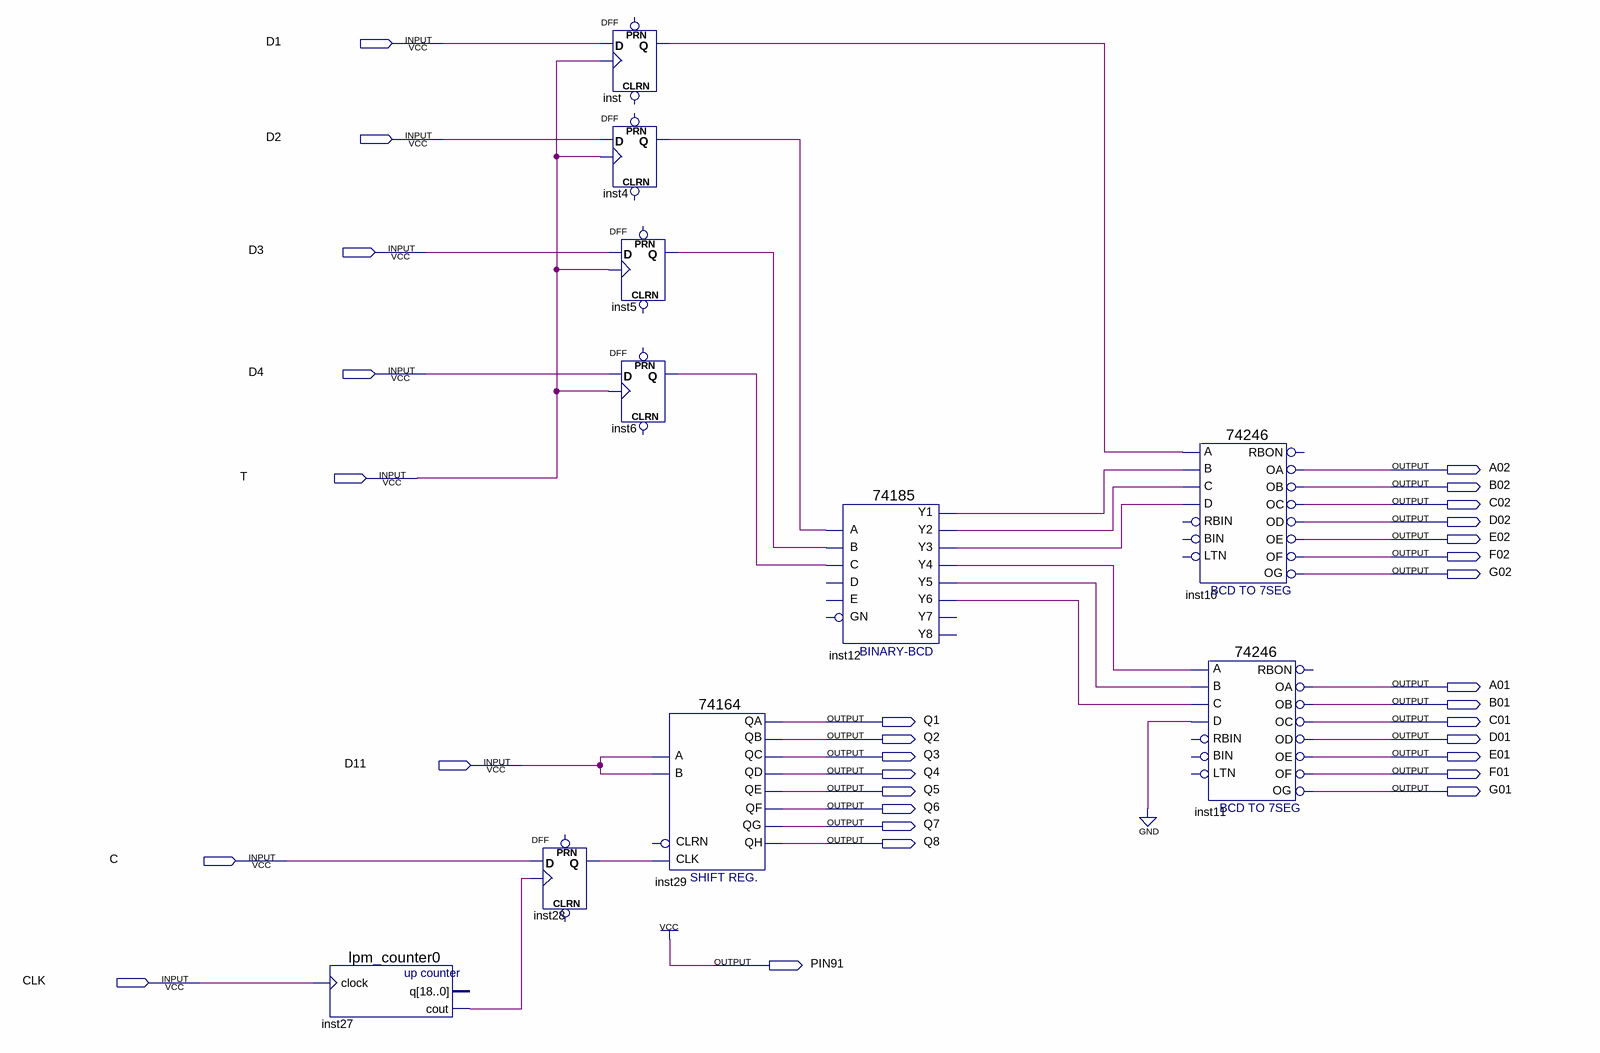
[diagram p0: schematic sheet]
// Quartus schematic registers.bdf as structural Verilog: 10 symbols, 31 pins
module registers (
  input  D1,
  input  D2,
  input  D3,
  input  D4,
  input  T,
  input  D11,
  input  C,
  input  CLK,
  output A02,
  output B02,
  output C02,
  output D02,
  output E02,
  output F02,
  output G02,
  output A01,
  output B01,
  output Q1,
  output C01,
  output Q2,
  output D01,
  output Q3,
  output E01,
  output Q4,
  output F01,
  output Q5,
  output G01,
  output Q6,
  output Q7,
  output Q8,
  output PIN91
);

  wire inst4_q, inst5_q, inst6_q, inst12_y1, inst12_y2, inst12_y3, inst12_y4, inst12_y5, inst12_y6,
       inst27_cout, inst28_q, inst_q;

  lpm_counter0 inst27 (.clock(CLK), .cout(inst27_cout));  // open: q
  DFF inst28 (.CLK(inst27_cout), .D(C), .Q(inst28_q));  // open: CLRN, PRN
  DFF inst (.CLK(T), .D(D1), .Q(inst_q));  // open: CLRN, PRN
  DFF inst4 (.CLK(T), .D(D2), .Q(inst4_q));  // open: CLRN, PRN
  DFF inst5 (.CLK(T), .D(D3), .Q(inst5_q));  // open: CLRN, PRN
  DFF inst6 (.CLK(T), .D(D4), .Q(inst6_q));  // open: CLRN, PRN
  \74164  inst29 (
    .CLK(inst28_q), .B(D11), .A(D11), .QD(Q4), .QC(Q3), .QA(Q1), .QF(Q6), .QH(Q8), .QG(Q7), .QE(Q5), .QB(Q2));  // open: CLRN
  \74185  inst12 (
    .A(inst4_q), .B(inst5_q), .C(inst6_q), .Y1(inst12_y1), .Y3(inst12_y3), .Y2(inst12_y2), .Y5(inst12_y5),
    .Y4(inst12_y4), .Y6(inst12_y6));  // open: D, E, GN, Y8, Y7
  \74246  inst10 (
    .B(inst12_y1), .A(inst_q), .D(inst12_y3), .C(inst12_y2), .OD(D02), .OC(C02), .OB(B02), .OE(E02),
    .OF(F02), .OA(A02), .OG(G02));  // open: RBIN, LTN, BIN, RBON
  \74246  inst11 (
    .B(inst12_y5), .A(inst12_y4), .D(1'b0), .C(inst12_y6), .OD(D01), .OC(C01), .OB(B01), .OE(E01), .OF(F01),
    .OA(A01), .OG(G01));  // open: RBIN, LTN, BIN, RBON

  assign PIN91 = 1'b1;
endmodule
